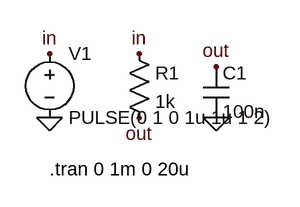
[diagram p0: schematic rc_tran.asc]
rc_tran.asc, the LTspice schematic file:
Version 4
SHEET 1 880 680
FLAG 0 16 in
FLAG 0 96 0
FLAG 112 16 in
FLAG 112 96 out
FLAG 208 32 out
FLAG 208 96 0
SYMBOL voltage 0 0 R0
SYMATTR InstName V1
SYMATTR Value PULSE(0 1 0 1u 1u 1 2)
SYMBOL res 96 0 R0
SYMATTR InstName R1
SYMATTR Value 1k
SYMBOL cap 192 32 R0
SYMATTR InstName C1
SYMATTR Value 100n
TEXT 0 160 Left 2 !.tran 0 1m 0 20u

The netlist it stands for:
* rc_tran.asc
V1 in 0 PULSE(0 1 0 1u 1u 1 2)
R1 in out 1k
C1 out 0 100n
.tran 0 1m 0 20u
.backanno
.end